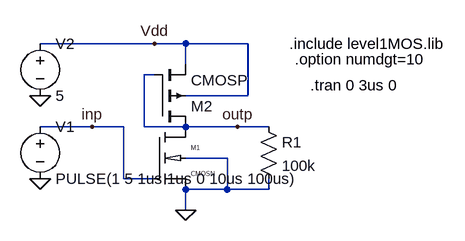
[diagram p0: schematic inverter_sat.asc]
inverter_sat.asc, the LTspice schematic file:
Version 4
SHEET 1 880 680
WIRE 144 48 -32 48
WIRE 192 48 144 48
WIRE 288 48 192 48
WIRE 192 80 192 48
WIRE 144 96 128 96
WIRE 288 128 288 48
WIRE 288 128 192 128
WIRE 48 176 -32 176
WIRE 96 176 48 176
WIRE 128 176 128 96
WIRE 192 176 128 176
WIRE 272 176 192 176
WIRE 320 176 272 176
WIRE 256 224 192 224
WIRE 96 256 96 176
WIRE 144 256 96 256
WIRE 256 272 256 224
WIRE 256 272 192 272
WIRE 320 272 320 256
WIRE 320 272 256 272
WIRE 192 304 192 272
FLAG 192 304 0
FLAG -32 128 0
FLAG -32 256 0
FLAG 144 48 Vdd
FLAG 272 176 outp
FLAG 48 176 inp
SYMBOL cmosn 144 176 R0
SYMATTR InstName M1
SYMATTR Value2 l=0.36u w=0.72u
SYMBOL cmosp 144 176 M180
SYMATTR InstName M2
SYMATTR Value2 l=0.36u w=1.44u
SYMBOL voltage -32 160 R0
WINDOW 123 0 0 Left 2
WINDOW 39 0 0 Left 2
SYMATTR InstName V1
SYMATTR Value PULSE(1 5 1us 1us 0 10us 100us)
SYMBOL voltage -32 32 R0
WINDOW 123 0 0 Left 2
WINDOW 39 0 0 Left 2
SYMATTR InstName V2
SYMATTR Value 5
SYMBOL res 304 160 R0
SYMATTR InstName R1
SYMATTR Value 100k
TEXT 352 48 Left 2 !.include level1MOS.lib
TEXT 384 112 Left 2 !.tran 0 3us 0
TEXT 360 72 Left 2 !.option numdgt=10

The netlist it stands for:
* inverter_sat.asc
M1 outp inp 0 0 CMOSN l=0.36u w=0.72u
M2 outp outp Vdd Vdd CMOSP l=0.36u w=1.44u
V1 inp 0 PULSE(1 5 1us 1us 0 10us 100us)
V2 Vdd 0 5
R1 outp 0 100k
.model NMOS NMOS
.model PMOS PMOS
.lib standard.mos
.include level1MOS.lib
.tran 0 3us 0
.option numdgt=10
.lib tsmc018.lib
.backanno
.end

* Results of the author's LTspice run, read from the files saved beside the schematic
* Operating Point, zero values left out:
*   V(outp) = 3.631 V
*   V(inp) = 1 V
*   V(vdd) = 5 V
*   Id(M2) = -153.9 µA
*   Ib(M2) = 1.379 pA
*   Is(M2) = 153.9 µA
*   Id(M1) = 117.6 µA
*   Ib(M1) = -3.641 pA
*   Is(M1) = -117.6 µA
*   I(R1) = 36.31 µA
*   I(V2) = -153.9 µA
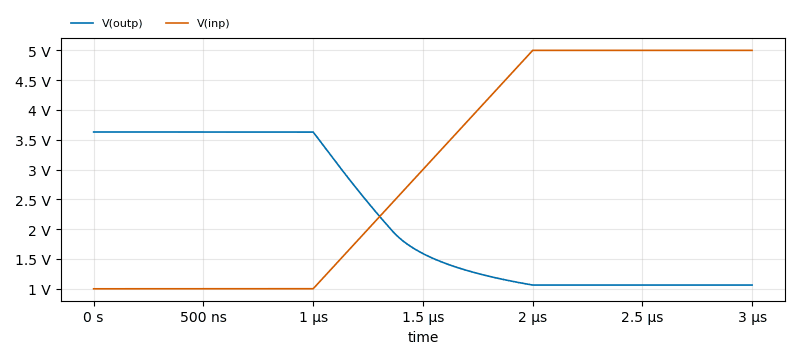
[diagram p1: Transient Analysis of inverter_sat.asc, plotted from the saved traces]
* Transient Analysis, 1 run:
*   V(outp): min 1.063 V, max 3.631 V, average 2.193 V, rms 2.479 V, last 1.063 V
*   V(inp): min 1 V, max 5 V, average 3 V, rms 3.48 V, last 5 V